# Altium schematic sheet MilliNut.SchDoc
size A3; PageSetup: Record=PageOptions|CenterHorizontal=True|CenterVertical=True|PrintScale=1.00|XCorrection=1.00|YCorrection=1.00|PrintKind=1|BorderSize=5000000|LeftOffset=0|BottomOffset=0|Orientation=2|PaperLength=1000|PaperWidth=1000|Scale=100|PaperSource=7|PrintQuality=-4|MediaType=1|DitherType=10|PaperKind=A3|PrintScaleMode=1
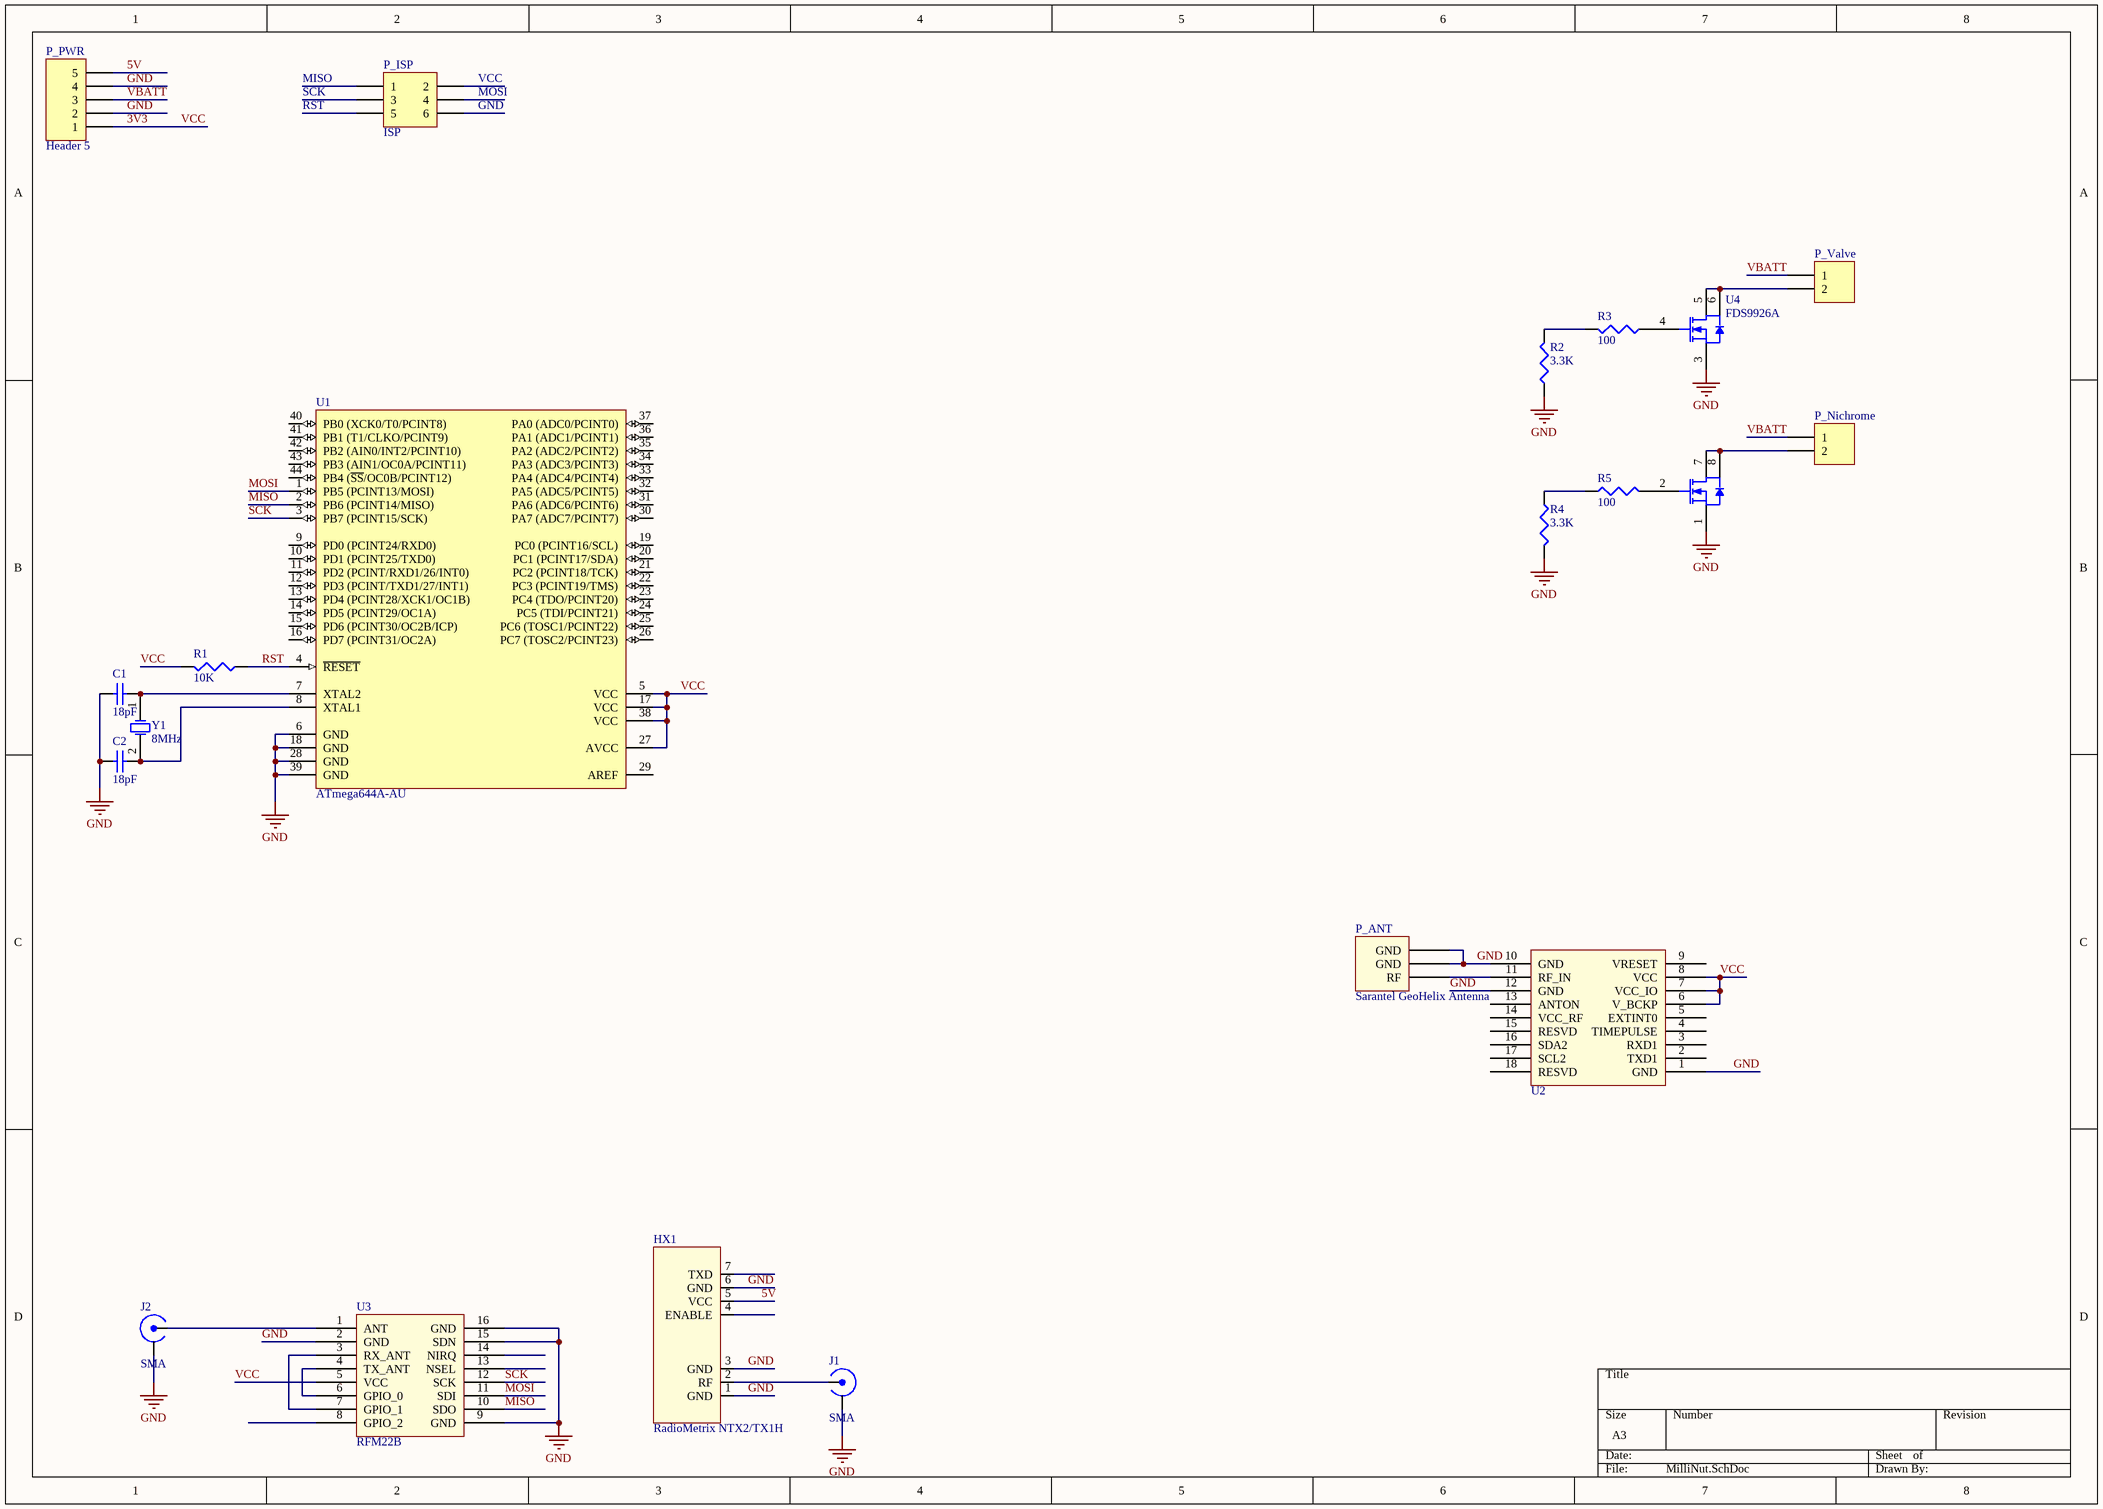
[diagram p0: MilliNut.SchDoc]

## Parts
C1  value 18pF  [1608[0603]]  (hidden comment: C0805)
C2  value 18pF  [1608[0603]]  (hidden comment: C0805)
HX1  RadioMetrix NTX2/TX1H  [HX1_Vertical]
J1  value SMA  [CON SMA PCB 90]  (hidden comment: SMA_L)
J2  value SMA  [CON SMA PCB 90]  (hidden comment: SMA_L)
P_ANT  Sarantel GeoHelix Antenna  [Sarantel SL1202RH]
P_ISP  ISP  [HDR2X3]
P_Nichrome  Header 2  [HDR1X2]  (value not drawn)
P_PWR  Header 5  [HDR1X5]
P_Valve  Header 2  [HDR1X2]  (value not drawn)
R1  value 10K  [J1-0603]  (hidden comment: Res3)
R2  value 3.3K  [1608[0603]]  (hidden comment: Res3)
R3  value 100  [1608[0603]]  (hidden comment: Res3)
R4  value 3.3K  [1608[0603]]  (hidden comment: Res3)
R5  value 100  [1608[0603]]  (hidden comment: Res3)
U1  ATmega644A-AU  [44A_M]
U2  uBlox MAX-6Q  [MAX-6Q]  (value not drawn)
U3  RFM22B  [RFM22B]
U4  FDS9926A  [SO8_M]
Y1  8MHz  [ABM3_XTAL]

## Nets
GND: C1.1 C2.1 HX1.1(GND) HX1.3(GND) HX1.6(GND) J1.2 J2.2 P_ANT.2(GND) P_ANT.3(GND) P_ISP.6 P_PWR.2 P_PWR.4 R2.1 R4.2 U1.6(GND) U1.18(GND) U1.28(GND) U1.39(GND) U2.1(GND) U2.10(GND) U2.12(GND) U3.2(GND) U3.9(GND) U3.15(SDN) U3.16(GND) U4.1(S) U4.3(S)
3V3: P_ISP.2 P_PWR.1 R1.2 U1.5(VCC) U1.17(VCC) U1.27(AVCC) U1.38(VCC) U2.6(V_BCKP) U2.7(VCC_IO) U2.8(VCC) U3.5(VCC)  [also labelled VCC]
5V: HX1.5(VCC) P_PWR.5
MISO: P_ISP.1 U1.2(PB6_(PCINT14/MISO)) U3.10(SDO)
MOSI: P_ISP.4 U1.1(PB5_(PCINT13/MOSI)) U3.11(SDI)
RST: P_ISP.5 R1.1 U1.4(~{RESET})
SCK: P_ISP.3 U1.3(PB7_(PCINT15/SCK)) U3.12(SCK)
VBATT: P_Nichrome.1 P_PWR.3 P_Valve.1
NetC1_2: C1.2 U1.7(XTAL2) Y1.1(OSC1)
NetC2_2: C2.2 U1.8(XTAL1) Y1.2(OSC2)
NetHX1_2: HX1.2(RF) J1.1
NetJ2_1: J2.1 U3.1(ANT)
NetP_ANT_1: P_ANT.1(RF) U2.11(RF_IN)
NetP_Nichrome_2: P_Nichrome.2 U4.7(D) U4.8(D)
NetP_Valve_2: P_Valve.2 U4.5(D) U4.6(D)
NetR2_2: R2.2 R3.2
NetR3_1: R3.1 U4.4(G)
NetR4_1: R4.1 R5.1
NetR5_2: R5.2 U4.2(G)
NetU3_3: U3.3(RX_ANT) U3.7(GPIO_1)
NetU3_4: U3.4(TX_ANT) U3.6(GPIO_0)

Not connected (* = marked no-connect by the designer): HX1 4(ENABLE) 7(TXD); U1 9(PD0_(PCINT24/RXD0)) 10(PD1_(PCINT25/TXD0)) 11(PD2_(PCINT/RXD1/26/INT0)) 12(PD3_(PCINT/TXD1/27/INT1)) 13(PD4_(PCINT28/XCK1/OC1B)) 14(PD5_(PCINT29/OC1A)) 15(PD6_(PCINT30/OC2B/ICP)) 16(PD7_(PCINT31/OC2A)) 19(PC0_(PCINT16/SCL)) 20(PC1_(PCINT17/SDA)) 21(PC2_(PCINT18/TCK)) 22(PC3_(PCINT19/TMS)) 23(PC4_(TDO/PCINT20)) 24(PC5_(TDI/PCINT21)) 25(PC6_(TOSC1/PCINT22)) 26(PC7_(TOSC2/PCINT23)) 29(AREF) 30(PA7_(ADC7/PCINT7)) 31(PA6_(ADC6/PCINT6)) 32(PA5_(ADC5/PCINT5)) 33(PA4_(ADC4/PCINT4)) 34(PA3_(ADC3/PCINT3)) 35(PA2_(ADC2/PCINT2)) 36(PA1_(ADC1/PCINT1)) 37(PA0_(ADC0/PCINT0)) 40(PB0_(XCK0/T0/PCINT8)) 41(PB1_(T1/CLKO/PCINT9)) 42(PB2_(AIN0/INT2/PCINT10)) 43(PB3_(AIN1/OC0A/PCINT11)) 44(PB4_(~{SS}/OC0B/PCINT12)); U2 2(TXD1) 3(RXD1) 4(TIMEPULSE) 5(EXTINT0) 9(VRESET) 13(ANTON) 14(VCC_RF) 15(RESVD) 16(SDA2) 17(SCL2) 18(RESVD); U3 8(GPIO_2) 13(NSEL) 14(NIRQ)

## Library data of the parts
C1 C2 = C0805: Ceramic Chip Capacitor - Standard; Note: Footprint corresponds to dimensions for bulk cassette packaging. This case size has tightened tolerances.; Published: 17-Jul-2002; LatestRevisionDate: 19-Mar-2004; LatestRevisionNote: Silkscreen size reduced.; DatasheetDocument: Mar-2001; PackageDocument: Mar-2001; PackageReference: 0805; Publisher: Altium Limited; Code_JEITA: 0805; Code_IPC: 2012[0805]; ComponentLink1Description: Manufacturer Link; ComponentLink1URL: http://www.kemet.com/; ComponentLink2Description: Datasheet; ComponentLink2URL: http://www.kemet.com/kemet/web/homepage/kechome.nsf/vapubfilesname/F3102TA.pdf/$file/F3102TA.pdf
J1 J2 = SMA_L: Power Connector
P_ISP = Header 3X2: Header, 3-Pin, Dual row; LatestRevisionDate: 17-Jul-2002; LatestRevisionNote: Re-released for DXP Platform.; Publisher: Altium Limited
P_Nichrome P_Valve = Header 2: Header, 2-Pin; LatestRevisionDate: 17-Jul-2002; LatestRevisionNote: Re-released for DXP Platform.; Publisher: Altium Limited
P_PWR = Header 5: Header, 5-Pin; LatestRevisionDate: 17-Jul-2002; LatestRevisionNote: Re-released for DXP Platform.; Publisher: Altium Limited
R1-R5 = Res3: Resistor; Published: 8-Jun-2000; LatestRevisionDate: 29-May-2009; LatestRevisionNote: IPC-7351 Footprint Added.; PackageReference: J1-0603; Publisher: Altium Limited; PackageDescription: Chip Resistor
U1 = ATmega644A-AU: 8-bit AVR Microcontroller, 64KB Flash, 2KB EEPROM, 4KB SRAM, 44-pin TQFP, Industrial Grade (-40°C to 85°C); Published: 1-Apr-2010; DatasheetVersion: revA, Jan-2010; PackageVersion: rev.B, Oct-2001; PackageReference: 44A; Publisher: Altium Limited; PackageDescription: 44-Pin Plastic Thin Profile Quad Flat Pack, 10 x 10 x 1.0 mm Body, 0.8 mm Pitch (TQFP); Supplier 1: Digi-Key; Supplier Part Number 1: ATMEGA644A-AU-ND; Supplier 2: Mouser; Supplier Part Number 2: 556-ATMEGA644A-AU; ComponentLink1Description: Manufacturer Link; ComponentLink1URL: http://www.atmel.com/products/avr/default.asp?; ComponentLink2Description: ATmega164A/164PA/324A/324PA/644A/644PA/1284/1284P Datasheet; ComponentLink2URL: http://www.atmel.com/dyn/resources/prod_documents/doc8272.pdf; ComponentLink3Description: ATmega164A/164PA/324A/324PA/644A/644PA/1284/1284P Summary; ComponentLink3URL: http://www.atmel.com/dyn/resources/prod_documents/8272S.pdf; ComponentLink4Description: Atmel.com Home; ComponentLink4URL: http://www.atmel.com
U3 = RFM22B-S2
Y1 = ECS-110-S-1: Crystal Oscillator; Published: 17-Jul-2002; DatasheetDocument: 18-Apr-2000; PackageReference: HC-49U; Publisher: Altium Limited; ComponentLink1Description: Manufacturer Link; ComponentLink1URL: http://www.ecsxtal.com/; ComponentLink2Description: Datasheet; ComponentLink2URL: http://www.ecsxtal.com/pdf2/HC49U.PDF